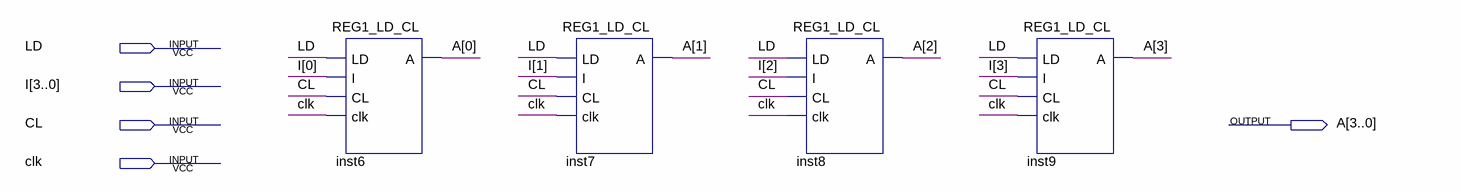
[diagram p0: schematic sheet]
// Quartus schematic REG4_LD_CL.bdf as structural Verilog: 4 symbols, 5 pins
module REG4_LD_CL (
  input  LD,
  input  [3:0] I,
  input  CL,
  input  clk,
  output [3:0] A
);

  REG1_LD_CL inst6 (.LD(LD), .I(I[0]), .CL(CL), .clk(clk), .A(A[0]));
  REG1_LD_CL inst7 (.LD(LD), .I(I[1]), .CL(CL), .clk(clk), .A(A[1]));
  REG1_LD_CL inst8 (.LD(LD), .I(I[2]), .CL(CL), .clk(clk), .A(A[2]));
  REG1_LD_CL inst9 (.LD(LD), .I(I[3]), .CL(CL), .clk(clk), .A(A[3]));
endmodule
